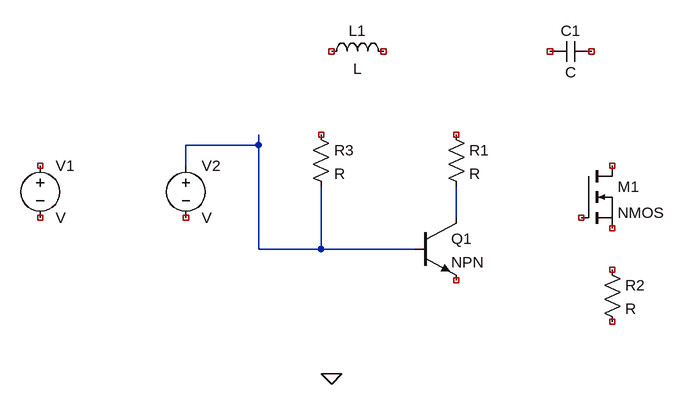
[diagram p0: schematic Draft1.asc]
Draft1.asc, the LTspice schematic file:
Version 4
SHEET 1 964 680
WIRE 336 64 336 48
WIRE 336 64 224 64
WIRE 224 96 224 64
WIRE 640 176 640 128
WIRE 336 224 336 64
WIRE 432 224 432 128
WIRE 432 224 336 224
WIRE 576 224 432 224
FLAG 448 416 0
SYMBOL voltage 0 80 R0
SYMATTR InstName V1
SYMBOL voltage 224 80 R0
SYMATTR InstName V2
SYMBOL nmos 832 96 R0
SYMATTR InstName M1
SYMBOL npn 576 176 R0
SYMATTR InstName Q1
SYMBOL res 624 32 R0
SYMATTR InstName R1
SYMBOL res 864 240 R0
SYMATTR InstName R2
SYMBOL res 416 32 R0
SYMATTR InstName R3
SYMBOL cap 848 -96 R90
WINDOW 0 0 32 VBottom 2
WINDOW 3 32 32 VTop 2
SYMATTR InstName C1
SYMBOL ind 432 -64 R270
WINDOW 0 32 56 VTop 2
WINDOW 3 5 56 VBottom 2
SYMATTR InstName L1

The netlist it stands for:
* Draft1.asc
V1 NC_01 NC_02 V
V2 N001 NC_03 V
M1 NC_04 NC_05 NC_06 NC_06 NMOS
Q1 N002 N001 NC_07 0 NPN
R1 NC_08 N002 R
R2 NC_09 NC_10 R
R3 NC_11 N001 R
C1 NC_12 NC_13 C
L1 NC_14 NC_15 L
.model NPN NPN
.model PNP PNP
.lib standard.bjt
.model NMOS NMOS
.model PMOS PMOS
.lib standard.mos
.backanno
.end